# EAGLE design untitled (EAGLE 9.5.2)
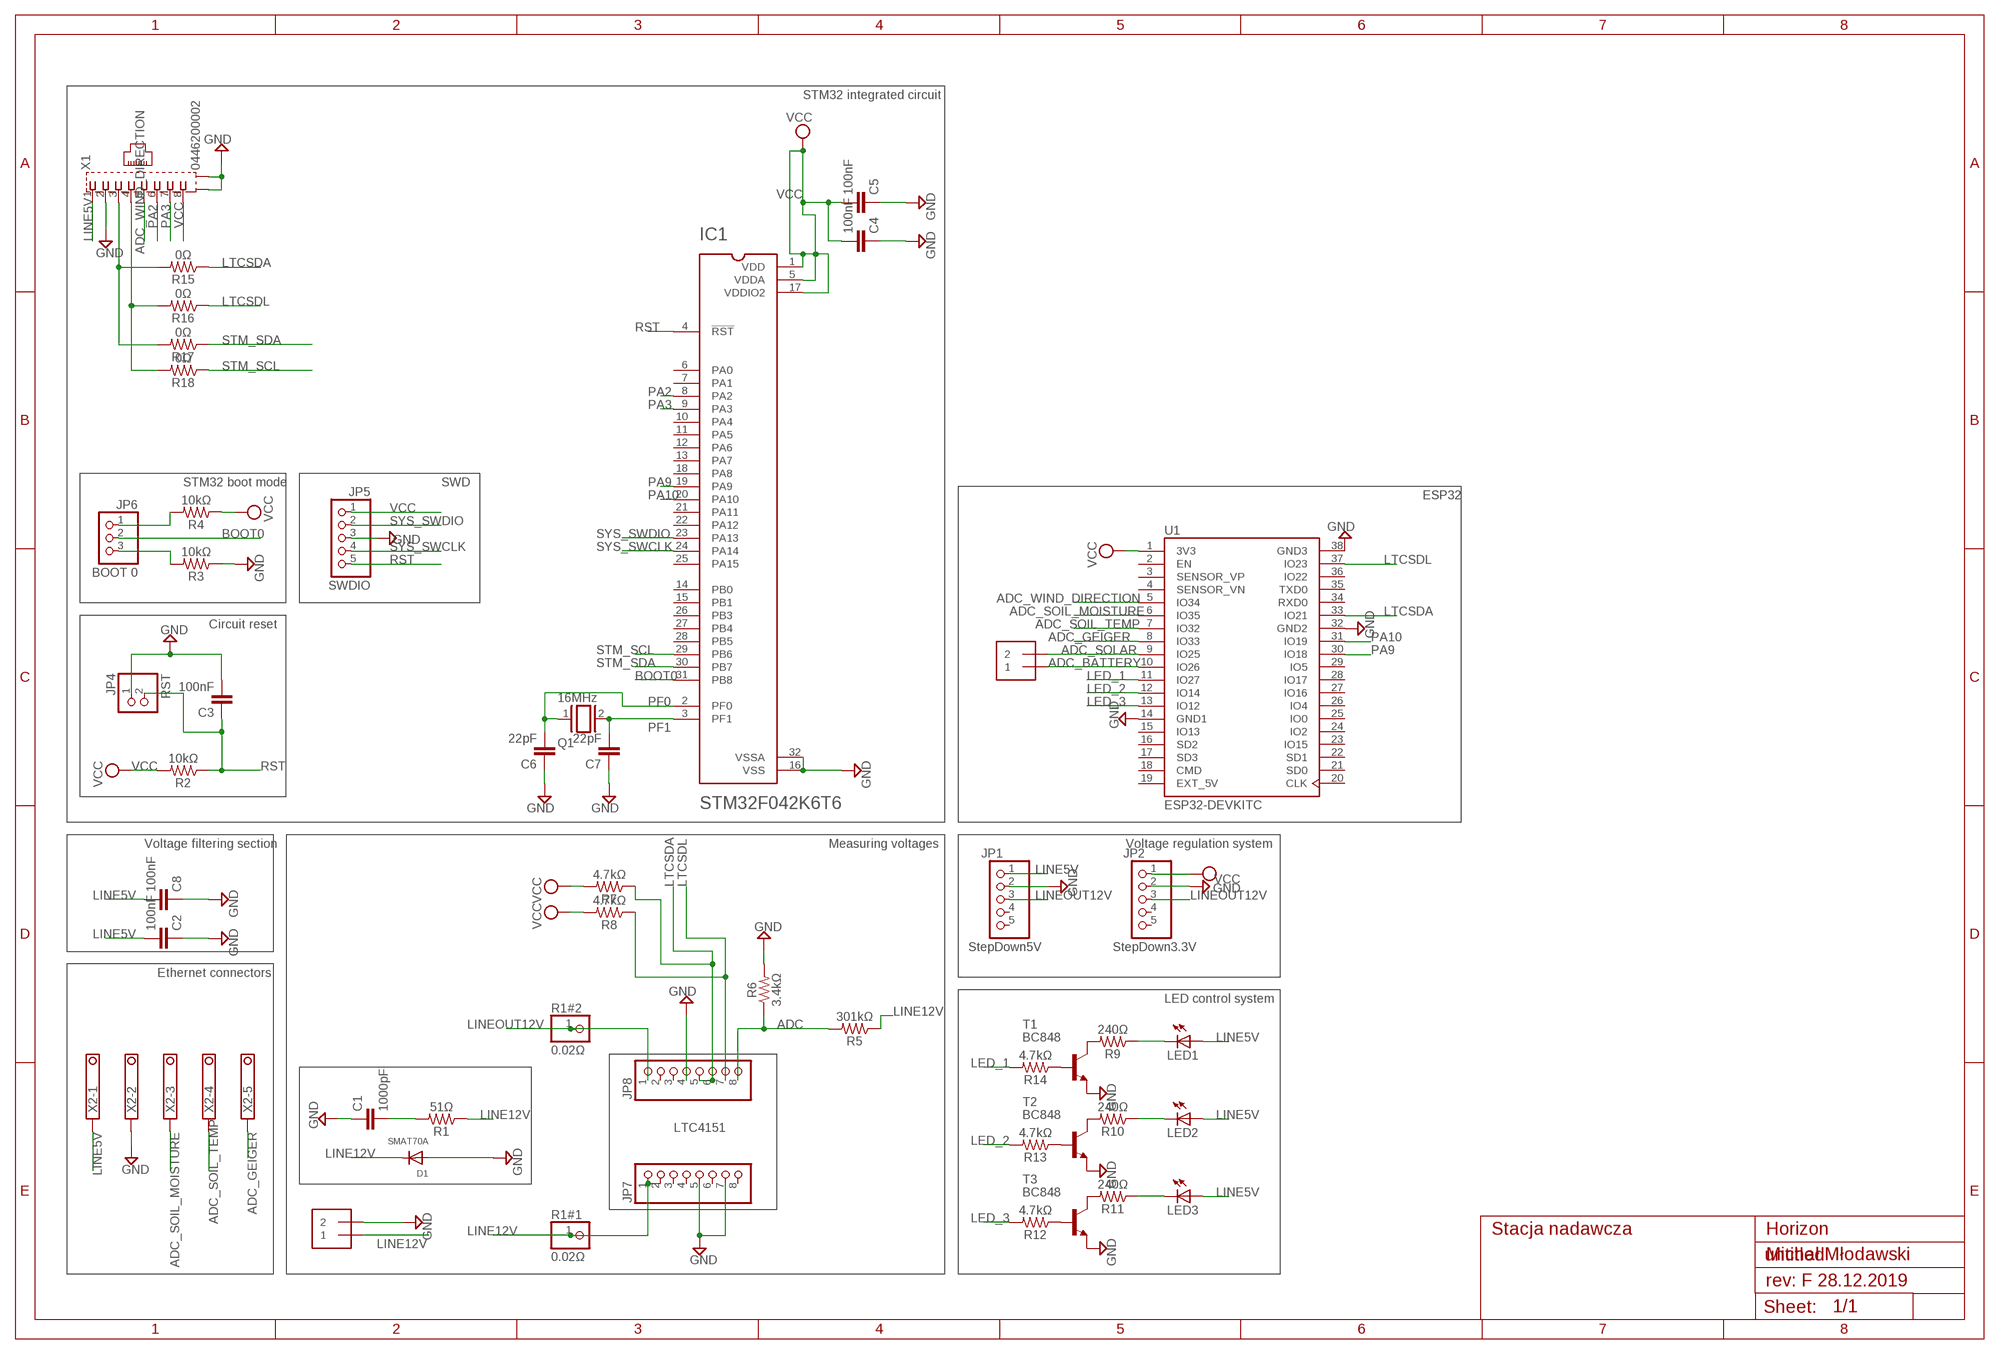
[diagram p0: schematic, sheet 1]

## Parts
C1  1000pF  10UF-1206-6.3V-20%  [1206]
C2  100nF  10UF-1206-6.3V-20%  [1206]
C3  100nF  10UF-1206-6.3V-20%  [1206]
C4  100nF  10UF-1206-6.3V-20%  [1206]
C5  100nF  10UF-1206-6.3V-20%  [1206]
C6  22pF  10UF-1206-6.3V-20%  [1206]
C7  22pF  10UF-1206-6.3V-20%  [1206]
C8  100nF  10UF-1206-6.3V-20%  [1206]
D1  SMAT70A  DIODESMA  [SMADIODE]
IC1  STM32F042K6T6  [QFP80P900X900X160-32N]
J1  1X2-3.5MM  [1X2-3.5MM]
J2  1X2-3.5MM  [1X2-3.5MM]
JP1  StepDown5V  PINHD-1X5  [1X05]
JP2  StepDown3.3V  PINHD-1X5  [1X05]
JP4  RST  PINHD-1X2  [1X02]
JP5  SWDIO  PINHD-1X5  [1X05]
JP6  BOOT 0  PINHD-1X3  [1X03]
JP7  PINHD-1X8  [1X08]
JP8  PINHD-1X8  [1X08]
LED1  LED5MM  [LED5MM]
LED2  LED5MM  [LED5MM]
LED3  LED5MM  [LED5MM]
Q1  16MHz  XTAL/S  [QS]
R1  51Ω  RESISTOR1206  [1206]
R1#1  0.02Ω  PINHD-1X1  [1X01]
R1#2  0.02Ω  PINHD-1X1  [1X01]
R2  10kΩ  RESISTOR1206  [1206]
R3  10kΩ  RESISTOR1206  [1206]
R4  10kΩ  RESISTOR1206  [1206]
R5  301kΩ  RESISTOR1206  [1206]
R6  3.4kΩ  RESISTOR1206  [1206]
R7  4.7kΩ  RESISTOR1206  [1206]
R8  4.7kΩ  RESISTOR1206  [1206]
R9  240Ω  RESISTOR1206  [1206]
R10  240Ω  RESISTOR1206  [1206]
R11  240Ω  RESISTOR1206  [1206]
R12  4.7kΩ  RESISTOR1206  [1206]
R13  4.7kΩ  RESISTOR1206  [1206]
R14  4.7kΩ  RESISTOR1206  [1206]
R15  0Ω  RESISTOR1206  [1206]
R16  0Ω  RESISTOR1206  [1206]
R17  0Ω  RESISTOR1206  [1206]
R18  0Ω  RESISTOR1206  [1206]
T1  BC848  [SOT23]
T2  BC848  [SOT23]
T3  BC848  [SOT23]
U1  ESP32-DEVKITC  [MODULE_ESP32-DEVKITC]
X1  0446200002  [0446200002]
X2  TERMINAL-BLOCK-3.5MM-5-PIN-LONG-PAD  [TERMINAL-BLOCK-5-PIN-3.5MM-LONG-PAD]

## Nets
ADC: JP8.8 R5.2 R6.1
ADC_BATTERY: J1.1 U1.10(IO26)
ADC_GEIGER: U1.8(IO33) X2.5
ADC_SOIL_MOISTURE: U1.6(IO35) X2.3
ADC_SOIL_TEMP: U1.7(IO32) X2.4
ADC_SOLAR: J1.2 U1.9(IO25)
ADC_WIND_DIRECTION: U1.5(IO34) X1.5
BOOT0: IC1.31(PB8) JP6.2
GND: C1.1 C2.1 C3.2 C4.1 C5.1 C6.1 C7.1 C8.1 D1.A IC1.16(VSS) IC1.32(VSSA) J2.2 JP1.2 JP2.2 JP4.1 JP5.3 JP7.5 JP7.7 JP8.4 R3.1 R6.2 T1.2(E) T2.2(E) T3.2(E) U1.14(GND1) U1.32(GND2) U1.38(GND3) X1.2 X1.S@1(S1) X1.S@2(S2) X2.2
LED_1: R14.2 U1.11(IO27)
LED_2: R13.2 U1.12(IO14)
LED_3: R12.2 U1.13(IO12)
LINE5V: C2.2 C8.2 JP1.1 LED1.A LED2.A LED3.A X1.1 X2.1
LINE12V: D1.C J2.1 JP7.1 JP7.2 R1#1.1 R1.1 R5.1
LINEOUT12V: JP1.3 JP2.3 JP8.1 R1#2.1
LTCSDA: JP8.5 JP8.6 R7.1 R15.1 U1.33(IO21)
LTCSDL: JP8.7 R8.1 R16.1 U1.37(IO23)
N$1: R9.2 T1.3(C)
N$2: R10.2 T2.3(C)
N$3: JP6.1 R4.2
N$4: JP6.3 R3.2
N$5: R11.2 T3.3(C)
N$6: C1.2 R1.2
N$7: R12.1 T3.1(B)
N$8: R13.1 T2.1(B)
N$9: R14.1 T1.1(B)
N$10: LED3.K(C) R11.1
N$11: LED2.K(C) R10.1
N$12: LED1.K(C) R9.1
N$13: R16.2 R18.2 X1.4
N$14: R15.2 R17.2 X1.3
PA2: IC1.8(PA2) X1.6
PA3: IC1.9(PA3) X1.7
PA9: IC1.19(PA9) U1.30(IO18)
PA10: IC1.20(PA10) U1.31(IO19)
PF0: C6.2 IC1.2(PF0) Q1.1
PF1: C7.2 IC1.3(PF1) Q1.2
RST: C3.1 IC1.4(!RST) JP4.2 JP5.5 R2.1
STM_SCL: IC1.29(PB6) R18.1
STM_SDA: IC1.30(PB7) R17.1
SYS_SWCLK: IC1.24(PA14) JP5.4
SYS_SWDIO: IC1.23(PA13) JP5.2
VCC: C4.2 C5.2 IC1.1(VDD) IC1.5(VDDA) IC1.17(VDDIO2) JP2.1 JP5.1 R2.2 R4.1 R7.2 R8.2 U1.1(3V3) X1.8
Unconnected: IC1.6(PA0) IC1.7(PA1) IC1.10(PA4) IC1.11(PA5) IC1.12(PA6) IC1.13(PA7) IC1.14(PB0) IC1.15(PB1) IC1.18(PA8) IC1.21(PA11) IC1.22(PA12) IC1.25(PA15) IC1.26(PB3) IC1.27(PB4) IC1.28(PB5) JP1.4 JP1.5 JP2.4 JP2.5 JP7.3 JP7.4 JP7.6 JP7.8 JP8.2 JP8.3 U1.2(EN) U1.3(SENSOR_VP) U1.4(SENSOR_VN) U1.15(IO13) U1.16(SD2) U1.17(SD3) U1.18(CMD) U1.20(CLK) U1.21(SD0) U1.22(SD1) U1.23(IO15) U1.24(IO2) U1.25(IO0) U1.26(IO4) U1.27(IO16) U1.28(IO17) U1.29(IO5) U1.34(RXD0) U1.35(TXD0) U1.36(IO22)

## Notes on the sheet
- STM32 integrated circuit
- STM32 boot mode | SWD
- ESP32
- Circuit reset
- Voltage filtering section | Measuring voltages | Voltage regulation system
- Ethernet connectors
- LED control system
- LTC4151
- Stacja nadawcza | Horizon
- Michał Młodawski
- rev: F 28.12.2019

## Power pins joined to a net without a drawn wire
EXT_5V: U1.19(EXT_5V)

## Library data of the parts
C1-C8 = SparkFun-Capacitors:10UF: 10.0µF ceramic capacitors A capacitor is a passive two-terminal electrical component used to store electrical energy temporarily in an electric field.; PROD_ID: CAP-10057; VALUE: 10uF
D1 = adafruit:DIODE: Diode SMADIODE - SMA Surface Mount Package 20V 1A Schottky Diode Digikey: 641-1014-6-ND DO-1N4148 - Through Hole Small Current Diode SOD-123 20V 1 A (.5mV Vf) Schottky Diode - Digikey: MBRX120TPMSCT-ND SOD-323 10V 570mA (.38mV Vf, 3ns) Schottky Diode - Digikey: ZLLS410CT-ND SOD-523 30V 30mA Schottky Diode (RB751S-40TE61) - Digikey: RB751S-40TE61CT-ND SOT23-R/W - SOT23 Package (R = Solder Paste/Reflow Ovens, W = Hand-Soldering) BAT54Film 40V 300mA - Digikey: 497-7162-1-ND
IC1 = STM32F042K6T6:STM32F042K6T6: Entry-level ARM Cortex-M0 MCU with 32 Kbytes Flash, 48 MHz CPU, USB, CAN and CEC functions; AVAILABILITY: Unavailable; DESCRIPTION: Entry-level ARM Cortex-M0 MCU with 32 Kbytes Flash, 48 MHz CPU, USB, CAN and CEC functions; MF: STMicroelectronics; MP: STM32F042K6T6; PACKAGE: LQFP-32 STMicroelectronics; PRICE: None
J1 J2 = adafruit:1X2: 3.5mm Terminal block http://www.ladyada.net/library/pcb/eaglelibrary.html
JP1 JP2 JP5 = pinhead:PINHD-1X5: PIN HEADER
JP4 = pinhead:PINHD-1X2: PIN HEADER
JP6 = pinhead:PINHD-1X3: PIN HEADER
JP7 JP8 = pinhead:PINHD-1X8: PIN HEADER
LED1-LED3 = adafruit:LED: LED OSRAM: - CHIPLED LG R971, LG N971, LY N971, LG Q971, LY Q971, LO R971, LY R971 LH N974, LH R974 LS Q976, LO Q976, LY Q976 LO Q996 - Hyper CHIPLED LW Q18S LB Q993, LB Q99A, LB R99A - SideLED LS A670, LO A670, LY A670, LG A670, LP A670 LB A673, LV A673, LT A673, LW A673 LH A674 LY A675 LS A676, LA A676, LO A676, LY A676, LW A676 LS A679, LY A679, LG A679 - Hyper Micro SIDELED® LS Y876, LA Y876, LO Y876, LY Y876 LT Y87S - SmartLED LW L88C, LW L88S LB L89C, LB L89S, LG L890 LS L89K, LO L89K, LY L89K LS L896, LA L896, LO L896, LY L896 - TOPLED LS T670, LO T670, LY T670, LG T670, LP T670 LSG T670, LSP T670, LSY T670, LOP T670, LYG T670 LG T671, LOG T671, LSG T671 LB T673, LV T673, LT T673, LW T673 LH T674 LS T676, LA T676, LO T676, LY T676, LB T676, LH T676, LSB T676, LW T676 LB T67C, LV T67C, LT T67C, LS T67K, LO T67K, LY T67K, LW E67C LS E67B, LA E67B, LO E67B, LY E67B, LB E67C, LV E67C, LT E67C LW T67C LS T679, LY T679, LG T679 LS T770, LO T770, LY T770, LG T770, LP T770 LB T773, LV T773, LT T773, LW T773 LH T774 LS E675, LA E675, LY E675, LS T675 LS T776, LA T776, LO T776, LY T776, LB T776 LHGB T686 LT T68C, LB T68C - Hyper Mini TOPLED® LB M676 - Mini TOPLED Santana® LG M470 LS M47K, LO M47K, LY M47K Source: http://www.osram.convergy.de/
Q1 = special:XTAL/S: CRYSTAL
R1-R18 = SparkFun-Resistors:RESISTOR: Generic Resistor Package
R1#1 R1#2 = adafruit:PINHD-1X1: Pin header 1x1 for 0.1" spacing With round pins
T1-T3 = transistor:BC848: NPN TRANSISTOR
U1 = ESP32-DEVKITC:ESP32-DEVKITC: ESP32-DEVKITC; AVAILABILITY: Unavailable; DESCRIPTION: EVAL BOARD FOR ESP-WROOM-32; MF: Espressif Systems; MP: ESP32-DEVKITC-32D-F; PACKAGE: None; PRICE: None
X1 = con-molex:0446200002: RJ-45 INVERTED MODULAR JACK ASSEMBLY WITH RJ-11 KEEPOUT FEATURE Source: Data sheet <http://www.farnell.com/datasheets/73207.pdf> MOLEX 0446200002 BUCHSE, RJ45, GESCHIRMT Source: Farnell <http://de.farnell.com/molex/0446200002/buchse-rj45-geschirmt/dp/9251910?ost=9251910>; MF: MOLEX; MPN: 0446200002; OC_FARNELL: 9251910
X2 = Rembrandt Electronics - Terminal Block 3-5mm v1-0:TERMINAL-BLOCK-3.5MM-5-PIN: Terminal Block 3.5mm Pitch: 3,5 mm Number of pins: 5 Created by Rembrandt Electronics www.rembrandtelectronics.com

## Board
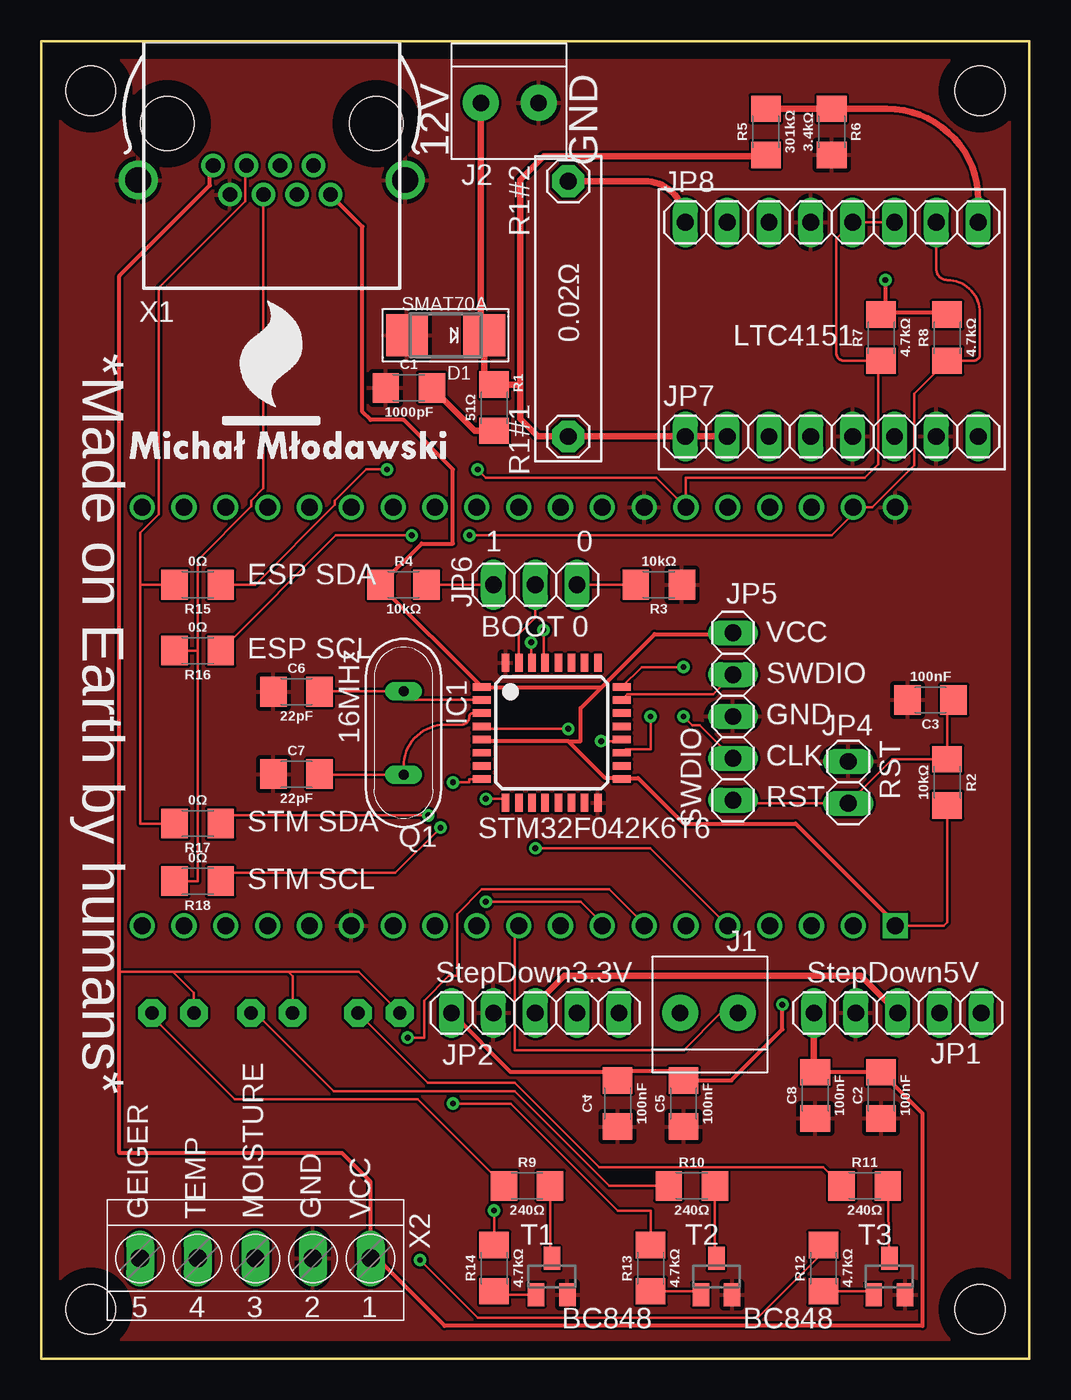
[diagram p1: board, top side]
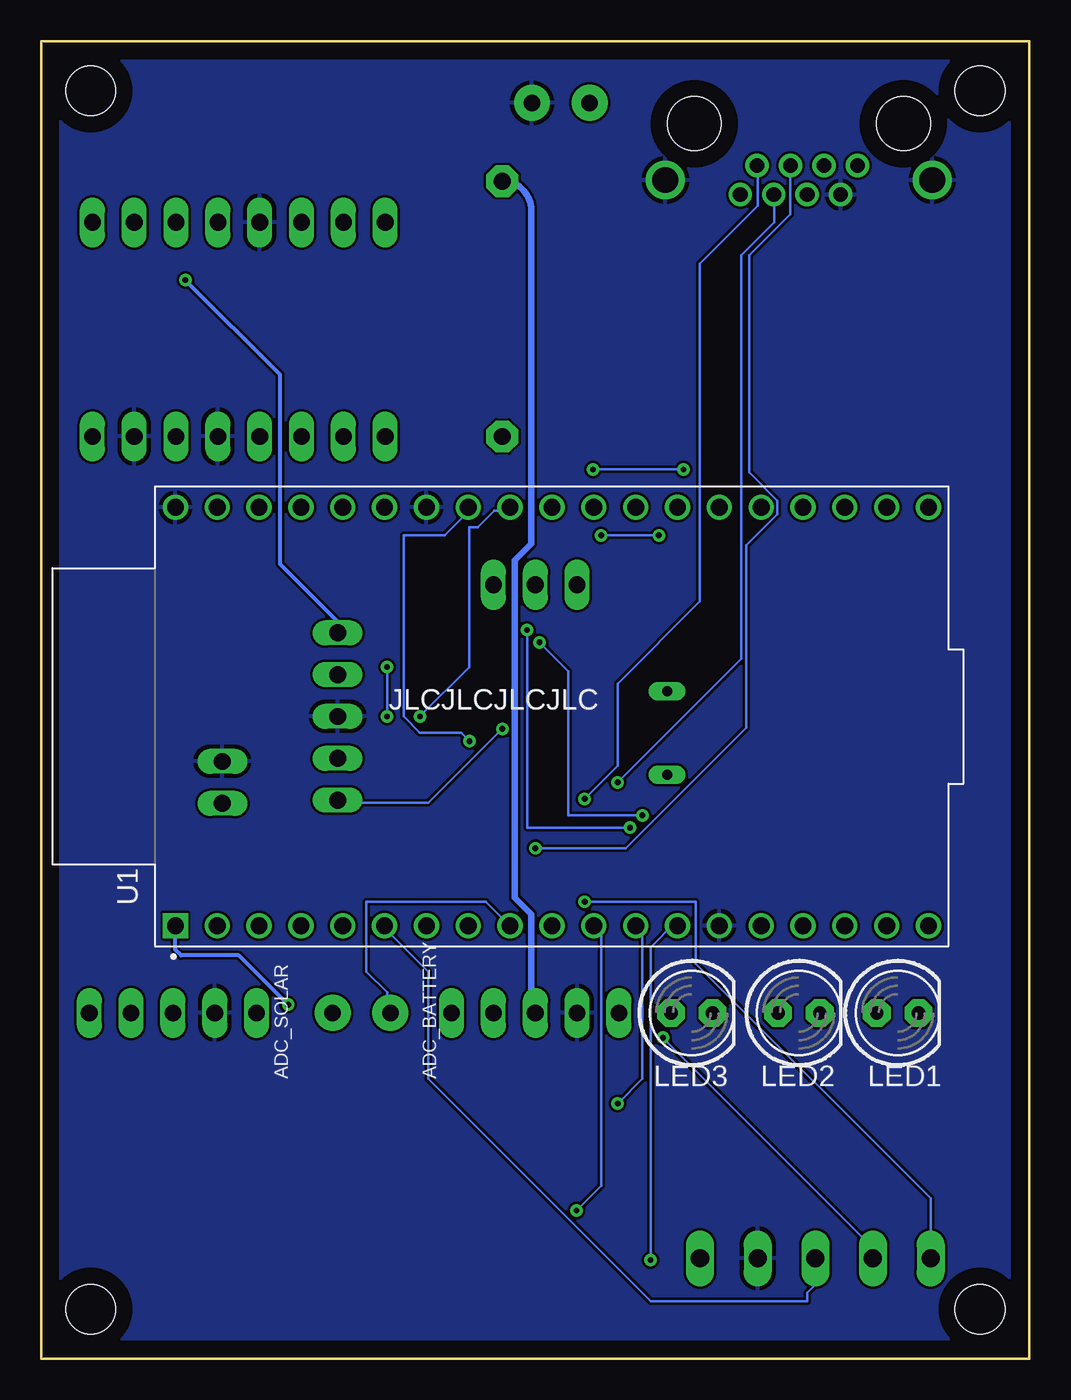
[diagram p2: board, bottom side, seen from below]

Size 60 x 80 mm. Coordinates in mm from the lower left corner, seen from the top.
Outline: 0,0 0,80 60,80 60,0 0,0
Copper layers (1*16): Top 0.035mm / dielectric 1.5mm / Bottom 0.035mm
Design rules "default": minimum track width 6mil, minimum drill 0.35mm, track to track 6mil, track to pad 6mil, pad to pad 6mil, via to via 6mil, smd to smd 6mil, copper to edge 40mil, drill to drill 6mil, minimum pad ring 10mil, minimum via ring 8mil, stop-mask expansion 4mil, vias tented up to drill 0mil, thermal gap 10mil
Holes 3 mm at 3,3 57,3 57,77 3,77

### Footprints (pad centres in the part's own frame; a part is rotated, then mirrored left to right if it is on the bottom)
1206 = smd 1.6 x 1.8: 1 -1.4,0; 2 1.4,0
SMADIODE = smd 2.54 x 2.54: A 2.349,0; C -2.349,0
QFP80P900X900X160-32N = smd 1.1 x 0.45: 1 -4.25,2.8; 2 -4.25,2; 3 -4.25,1.2; 4 -4.25,0.4; 5 -4.25,-0.4; 6 -4.25,-1.2; 7 -4.25,-2; 8 -4.25,-2.8; 17 4.25,-2.8; 18 4.25,-2; 19 4.25,-1.2; 20 4.25,-0.4; 21 4.25,0.4; 22 4.25,1.2; 23 4.25,2; 24 4.25,2.8 | smd 0.45 x 1.1: 9 -2.8,-4.25; 10 -2,-4.25; 11 -1.2,-4.25; 12 -0.4,-4.25; 13 0.4,-4.25; 14 1.2,-4.25; 15 2,-4.25; 16 2.8,-4.25; 25 2.8,4.25; 26 2,4.25; 27 1.2,4.25; 28 0.4,4.25; 29 -0.4,4.25; 30 -1.2,4.25; 31 -2,4.25; 32 -2.8,4.25
1X2-3.5MM = drill 1 pad 2.184: 1 1.8,0; 2 -1.7,0
1X05 = drill 1.016 long: 1 -5.08,0; 2 -2.54,0; 3 0,0; 4 2.54,0; 5 5.08,0
1X02 = drill 1.016 long: 1 -1.27,0; 2 1.27,0
1X03 = drill 1.016 long: 1 -2.54,0; 2 0,0; 3 2.54,0
1X08 = drill 1.016 long: 1 -8.89,0; 2 -6.35,0; 3 -3.81,0; 4 -1.27,0; 5 1.27,0; 6 3.81,0; 7 6.35,0; 8 8.89,0
LED5MM = drill 0.813 pad 1.676 octagon: A -1.27,0; K 1.27,0
QS = drill 0.61 long: 1 -2.54,0; 2 2.54,0
1X01 = drill 1.016 pad 1.93 octagon: 1 0,0
SOT23 = smd 1 x 1.4: 1 -0.95,-1.1; 2 0.95,-1.1; 3 0,1.1
MODULE_ESP32-DEVKITC = drill 1.02 square: 1 -12.7,22.85 | drill 1.02: 2 -12.7,20.31; 3 -12.7,17.77; 4 -12.7,15.23; 5 -12.7,12.69; 6 -12.7,10.15; 7 -12.7,7.61; 8 -12.7,5.07; 9 -12.7,2.53; 10 -12.7,-0.01; 11 -12.7,-2.55; 12 -12.7,-5.09; 13 -12.7,-7.63; 14 -12.7,-10.17; 15 -12.7,-12.71; 16 -12.7,-15.25; 17 -12.7,-17.79; 18 -12.7,-20.33; 19 -12.7,-22.87; 20 12.7,-22.87; 21 12.7,-20.33; 22 12.7,-17.79; 23 12.7,-15.25; 24 12.7,-12.71; 25 12.7,-10.17; 26 12.7,-7.63; 27 12.7,-5.09; 28 12.7,-2.55; 29 12.7,-0.01; 30 12.7,2.53; 31 12.7,5.07; 32 12.7,7.61; 33 12.7,10.15; 34 12.7,12.69; 35 12.7,15.23; 36 12.7,17.77; 37 12.7,20.31; 38 12.7,22.85
0446200002 = drill 0.889 pad 1.422: 1 3.556,2.54; 2 2.54,4.318; 3 1.524,2.54; 4 0.508,4.318; 5 -0.508,2.54; 6 -1.524,4.318; 7 -2.54,2.54; 8 -3.556,4.318 | drill 1.575 pad 2.286: S@1 -8.103,3.429; S@2 8.103,3.429 | hole 3.251: 6.35,0; -6.35,0
TERMINAL-BLOCK-5-PIN-3.5MM-LONG-PAD = drill 1.1 pad 1.7 long: 1 -7,-0.1; 2 -3.5,-0.1; 3 0,-0.1; 4 3.5,-0.1; 5 7,-0.1

### Placement (x,y rotation side)
C1  22.32,58.95 0 top
C2  51,16 90 top
C3  54,40 180 top
C4  35,15.5 90 top
C5  39,15.5 90 top
C6  15.5,40.5 0 top
C7  15.5,35.5 0 top
C8  47,16 90 top
D1  24.56,62.15 180 top
IC1  31,38 0 top
J1  40.5,21 0 top
J2  28.5,76.25 180 top
JP1  52,21 0 top
JP2  30,21 0 top
JP4  49,35 270 top
JP5  42,39 270 top
JP6  30,47 0 top
JP7  48,56 0 top
JP8  48,69 0 top
LED1  8,21 0 bottom
LED2  14,21 0 bottom
LED3  20.5,21 0 bottom
Q1  22,38 270 top
R1  27.5,57.75 270 top
R1#1  32,56 90 top
R1#2  32,71.5 90 top
R2  55,35 270 top
R3  37.5,47 180 top
R4  22,47 0 top
R5  44,74.5 90 top
R6  48,74.5 270 top
R7  51,62 90 top
R8  55,62 90 top
R9  29.5,10.5 0 top
R10  39.5,10.5 0 top
R11  50,10.5 0 top
R12  47.5,5.5 90 top
R13  37,5.5 90 top
R14  27.5,5.5 90 top
R15  9.5,47 180 top
R16  9.5,43 180 top
R17  9.5,32.5 180 top
R18  9.5,29 180 top
T1  31,5 0 top
T2  41,5 0 top
T3  51.5,5 0 top
U1  29,39 90 bottom
X1  14,75 180 top
X2  13,6 180 top

### Tracks (layer width: path | path; a pad name or v marks a point on that pad's centre or on a via)
ADC
  Top 0.406: R5.2 R6.1 51.35,75.9 arc-90 56.89,70.36 JP8.8
ADC_BATTERY
  Top 0.152: J1.1 41.25,21 39,18.75 28.75,18.75 28.75,26.25 U1.10
ADC_GEIGER  (via drill 0.35)
  Top 0.152: v27,27.75 32.75,27.75 34,26.5 U1.8
  Bottom 0.152: v27,27.75 20.25,27.75 20.25,24 6,9.75 X2.5
ADC_SOIL_MOISTURE
  Bottom 0.152: X2.3 13,4.5 13.5,4 13.5,3.5 23,3.5 36.5,17 36.5,23.5 39,26 U1.6
ADC_SOIL_TEMP  (via drill 0.35)
  Top 0.152: v22.25,19.5 23.25,19.5 23.25,21.75 24.75,23.25 25.25,23.25 25.25,27 26.75,28.5 34.5,28.5 36.5,26.5 U1.7
  Bottom 0.152: v22.25,19.5 9.5,6.75 X2.4
ADC_SOLAR
  Bottom 0.152: U1.9 31.75,26.5 33,27.75 40.25,27.75 40.25,23.5 39,22.25 39,21 J1.2
ADC_WIND_DIRECTION  (via drill 0.35)
  Top 0.152: U1.5 36.99,31 v30,31
  Bottom 0.152: X1.5 14.51,69.49 17,67 17,53.81 15.3,52.11 15.3,51.29 17.2,49.39 17.2,38.3 24.5,31 v30,31
BOOT0
  Top 0.152: JP6.2 30,45 29,44 IC1.31
GND
  pour Top: -0.5,80.5 -0.5,-0.5 60.5,-0.5 60.5,80.5
  pour Bottom: -1,81 -1,-1 61,-1 61,81
LED_1  (via drill 0.35)
  Top 0.152: v27.5,9 R14.2
  Bottom 0.152: v27.5,9 26,10.5 26,26 U1.11
LED_2  (via drill 0.35)
  Top 0.152: R13.2 37,9 35,9 28.5,15.5 v25,15.5
  Bottom 0.152: v25,15.5 23.5,17 23.5,26 U1.12
LED_3  (via drill 0.35)
  Top 0.152: v23,6 26.5,2.5 43.5,2.5 47.5,6.5 R12.2
  Bottom 0.152: v23,6 23,25 21.5,26.5 U1.13
LINE5V
  Top 0.152: 47,17.25 C8.2 | LED3.A 19.27,23.5 15,23.5 | 15,23.5 8,23.5 | 8,23.5 4.75,23.5 | LED2.A 15.27,23.23 15,23.5 | LED1.A 9.27,22.23 8,23.5
  Top 0.254: X1.1 10.25,72.25 10.25,71.25 4.75,65.75 4.75,23.5 4.75,12.5 18.25,12.5 20,10.75 20,6.5 | C8.2 C2.2 53.5,14.9 53.5,2 24.5,2 20,6.5 | X2.1 20,6.5
  Top 0.406: JP1.1 46.92,17.33 47,17.25
LINE12V
  Top 0.406: JP7.2 JP7.1 R1#1.1 30.15,56 29.07,57.08 29.07,59 | 29.07,59 29.07,71.58 30.5,73 43.9,73 R5.1 | 29.07,59 arc90 28.93,59.15 R1.1 27.5,59 26.91,59 D1.C 26.7,62.15 J2.1
LINEOUT12V
  Top 0.406: R1#2.1 36.61,71.5 arc-90 JP8.1 | JP2.3 30,21.5 31.75,23.25 49.75,23.25 JP1.3
  Bottom 0.406: R1#2.1 arc90 30.25,69.75 30.25,49.5 31.25,48.5 31.25,28 30.25,27 30.25,21.25 JP2.3
LTCSDA  (via drill 0.35)
  Top 0.152: JP8.6 JP8.5 48.27,68 48.27,61.08 arc90 48.75,60.6 R7.1 50.82,60.42 50.82,54.32 50,53.5 39.15,53.5 U1.33 37.35,53.5 27,53.5 v26.5,54 | R15.1 12.99,47 17.84,51.84 17.84,52.11 19.73,54 v21,54
  Bottom 0.152: v21,54 v26.5,54
LTCSDL  (via drill 0.35)
  Top 0.152: JP8.7 54.35,66.15 arc90 55,65.5 arc-90 57,63.5 57,61 arc-90 56.6,60.6 R8.1 53,58.6 53,54.26 50.45,51.7 U1.37 49.31,51.31 48,50 v26,50 | R16.1 17.9,50 v22.5,50
  Bottom 0.152: v22.5,50 v26,50
N$1
  Top 0.152: T1.3 30.9,6.2 R9.2
N$2
  Top 0.152: T2.3 40.9,6.2 R10.2
N$3
  Top 0.152: R4.2 JP6.1
N$4
  Top 0.152: R3.2 JP6.3
N$5
  Top 0.152: T3.3 R11.2
N$6
  Top 0.406: R1.2 26.32,56.35 C1.2
N$7
  Top 0.152: T3.1 50.35,4.1 R12.1
N$8
  Top 0.152: R13.1 39.85,4.1 T2.1
N$9
  Top 0.152: T1.1 27.7,3.9 R14.1
N$10
  Top 0.152: LED3.K 23.48,16.75 28.75,16.75 33.87,11.63 47.47,11.63 R11.1
N$11
  Top 0.152: LED2.K 13,21 17.75,16.25 28.75,16.25 34.5,10.5 R10.1
N$12
  Top 0.152: LED1.K 6.5,21 11.75,15.75 22.85,15.75 R9.1
N$13
  Top 0.152: X1.4 13.49,52.85 12.76,52.11 12.76,51.76 9.5,48.5 9.5,43 | 9.5,43 R16.2 | 9.5,43 9.5,29 R18.2
N$14
  Top 0.152: R15.2 6,47 | 6,47 6,32.5 R17.2 | 6,47 6,50.16 7.12,51.29 7.12,65.02 12.4,70.29 12.4,72.38 X1.3
PA2  (via drill 0.35)
  Top 0.152: IC1.8 26,35.2 26,35 v25,35
  Bottom 0.152: v25,35 17.5,42.5 17.5,67 15.5,69 15.5,70.66 X1.6
PA3  (via drill 0.35)
  Top 0.152: v27,34 28,34 IC1.9
  Bottom 0.152: v27,34 25,36 25,41 20,46 20,66.5 16.5,70 16.5,72 X1.7
PA9  (via drill 0.35)
  Top 0.152: v37,39 37,37 35.5,37 IC1.19
  Bottom 0.152: v37,39 34,42 34,50.5 33.5,50.5 32.5,51.5 32,51.5 U1.30
PA10  (via drill 0.35)
  Top 0.152: v34,37.5 35,37.5 IC1.20
  Bottom 0.152: v34,37.5 34.5,38 37,38 38,39 38,50 35.5,50 34,51.5 U1.31
PF0
  Top 0.152: C6.2 16.94,40.54 Q1.1 22,40 IC1.2
PF1
  Top 0.152: C7.2 16.94,35.46 Q1.2 22,35.96 arc-90 24.54,38.5 25.5,38.5 arc90 26,39 arc-90 26.2,39.2 IC1.3
RST  (via drill 0.35)
  Top 0.152: JP5.5 42.19,33.73 JP4.2 51.67,36.4 R2.1 55,39.6 C3.1 | v32,38.25 26.75,38.25 IC1.4
  Bottom 0.152: v32,38.25 36.5,33.75 42,33.75 JP5.5
STM_SCL  (via drill 0.35)
  Top 0.152: v30.5,44.25 30.5,42.25 IC1.29 | v24.25,32.25 21.5,29.5 11,29.5 11,29 R18.1
  Bottom 0.152: v30.5,44.25 30.5,32.25 v24.25,32.25
STM_SDA  (via drill 0.35)
  Top 0.152: v29.75,43.5 29.75,42.25 IC1.30 | v23.5,33 11,33 11,32.5 R17.1
  Bottom 0.152: v29.75,43.5 28,41.75 28,33 v23.5,33
SYS_SWCLK  (via drill 0.35)
  Top 0.152: JP5.4 40,38.46 39.54,38.46 v39,39 | IC1.24 36.45,42 v39,42
  Bottom 0.152: v39,42 v39,39
SYS_SWDIO
  Top 0.152: IC1.23 35.6,40.35 40.81,40.35 JP5.2
VCC  (via drill 0.35)
  Top 0.152: R2.2 55,26.5 54.8,26.3 U1.1 | 51,63.5 R7.2 51.25,63.65 | 55,63.5 R8.2 | 26.75,37.5 IC1.5 | 42,44 JP5.1 | 26.75,40.75 IC1.1 | 35.25,35.25 IC1.17 | 35,17.5 C4.2
  Top 0.254: 55,63.5 51,63.5 | 32,37.5 26.75,37.5 | 32,37.5 34.25,35.25 35.25,35.25 36.25,35.25 39,32.5 45.8,32.5 51.85,26.45 U1.1 | 42,44 37.25,44 34,40.75 | 34,40.75 32.75,39.5 32.75,37.5 32,37.5 | v51.25,65.5 51.25,63.65 | 34,40.75 26.75,40.75 | 35,17.5 39,17.5 C5.2 41.9,16.9 45,20 v45,21.5 | JP2.1 28.52,17.4 34.5,17.4 C4.2 | IC1.1 20.6,46.95 R4.1 23.1,49.5 25,49.5 25,54 22,57 20,57 19.5,57.5 19.5,68.74 X1.8
  Bottom 0.254: v51.25,65.5 45.5,59.75 45.5,48.25 42,44.75 JP5.1 | v45,21.5 48,24.5 51.5,24.5 51.85,24.85 U1.1

### Text on the board
tPlace: GND | 12V | *Made on Earth by humans* | LTC4151 | 1 | 0 | ESP SDA | ESP SCL | VCC | SWDIO | GND | CLK | RST | STM SDA | STM SCL | GEIGER | TEMP | MOISTURE | GND | VCC
bPlace: JLCJLCJLCJLC
bNames: ADC_BATTERY | ADC_SOLAR